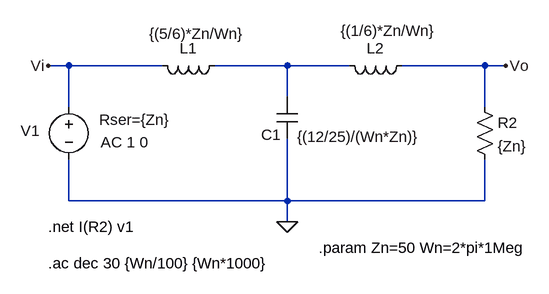
[diagram p0: schematic TS15_Rev2.asc]
TS15_Rev2.asc, the LTspice schematic file:
Version 4
SHEET 1 880 680
WIRE -16 112 -48 112
WIRE 128 112 -16 112
WIRE 320 112 208 112
WIRE 416 112 320 112
WIRE 624 112 496 112
WIRE 656 112 624 112
WIRE 320 160 320 112
WIRE -16 176 -16 112
WIRE 624 176 624 112
WIRE -16 320 -16 256
WIRE 320 320 320 224
WIRE 320 320 -16 320
WIRE 624 320 624 256
WIRE 624 320 320 320
WIRE 320 352 320 320
FLAG 320 352 0
FLAG 656 112 Vo
FLAG -48 112 Vi
SYMBOL ind 224 96 R90
WINDOW 0 5 56 VBottom 2
WINDOW 3 -49 43 VTop 2
SYMATTR InstName L1
SYMATTR Value {(5/6)*Zn/Wn}
SYMBOL cap 304 160 R0
WINDOW 0 -24 58 Left 2
WINDOW 3 31 61 Left 2
SYMATTR InstName C1
SYMATTR Value {(12/25)/(Wn*Zn)}
SYMBOL ind 512 96 R90
WINDOW 0 5 56 VBottom 2
WINDOW 3 -53 36 VTop 2
SYMATTR InstName L2
SYMATTR Value {(1/6)*Zn/Wn}
SYMBOL res 608 160 R0
SYMATTR InstName R2
SYMATTR Value {Zn}
SYMBOL voltage -16 160 R0
WINDOW 3 24 152 Left 2
WINDOW 123 49 70 Left 2
WINDOW 39 47 35 Left 2
WINDOW 0 -74 52 Left 2
SYMATTR Value ""
SYMATTR Value2 AC 1 0
SYMATTR SpiceLine Rser={Zn}
SYMATTR InstName V1
TEXT -48 360 Left 2 !.net I(R2) v1
TEXT 368 392 Left 2 !.param Zn=50 Wn=2*pi*1Meg
TEXT -48 416 Left 2 !.ac dec 30 {Wn/100} {Wn*1000}

The netlist it stands for:
* TS15_Rev2.asc
L1 N001 Vi {(5/6)*Zn/Wn}
C1 N001 0 {(12/25)/(Wn*Zn)}
L2 Vo N001 {(1/6)*Zn/Wn}
R2 Vo 0 {Zn}
V1 Vi 0 AC 1 0 Rser={Zn}
.net I(R2) v1
.param Zn=50 Wn=2*pi*1Meg
.ac dec 30 {Wn/100} {Wn*1000}
.backanno
.end